# EAGLE design WeMos-Matrix-Shield-DMA (EAGLE 7.7.0)
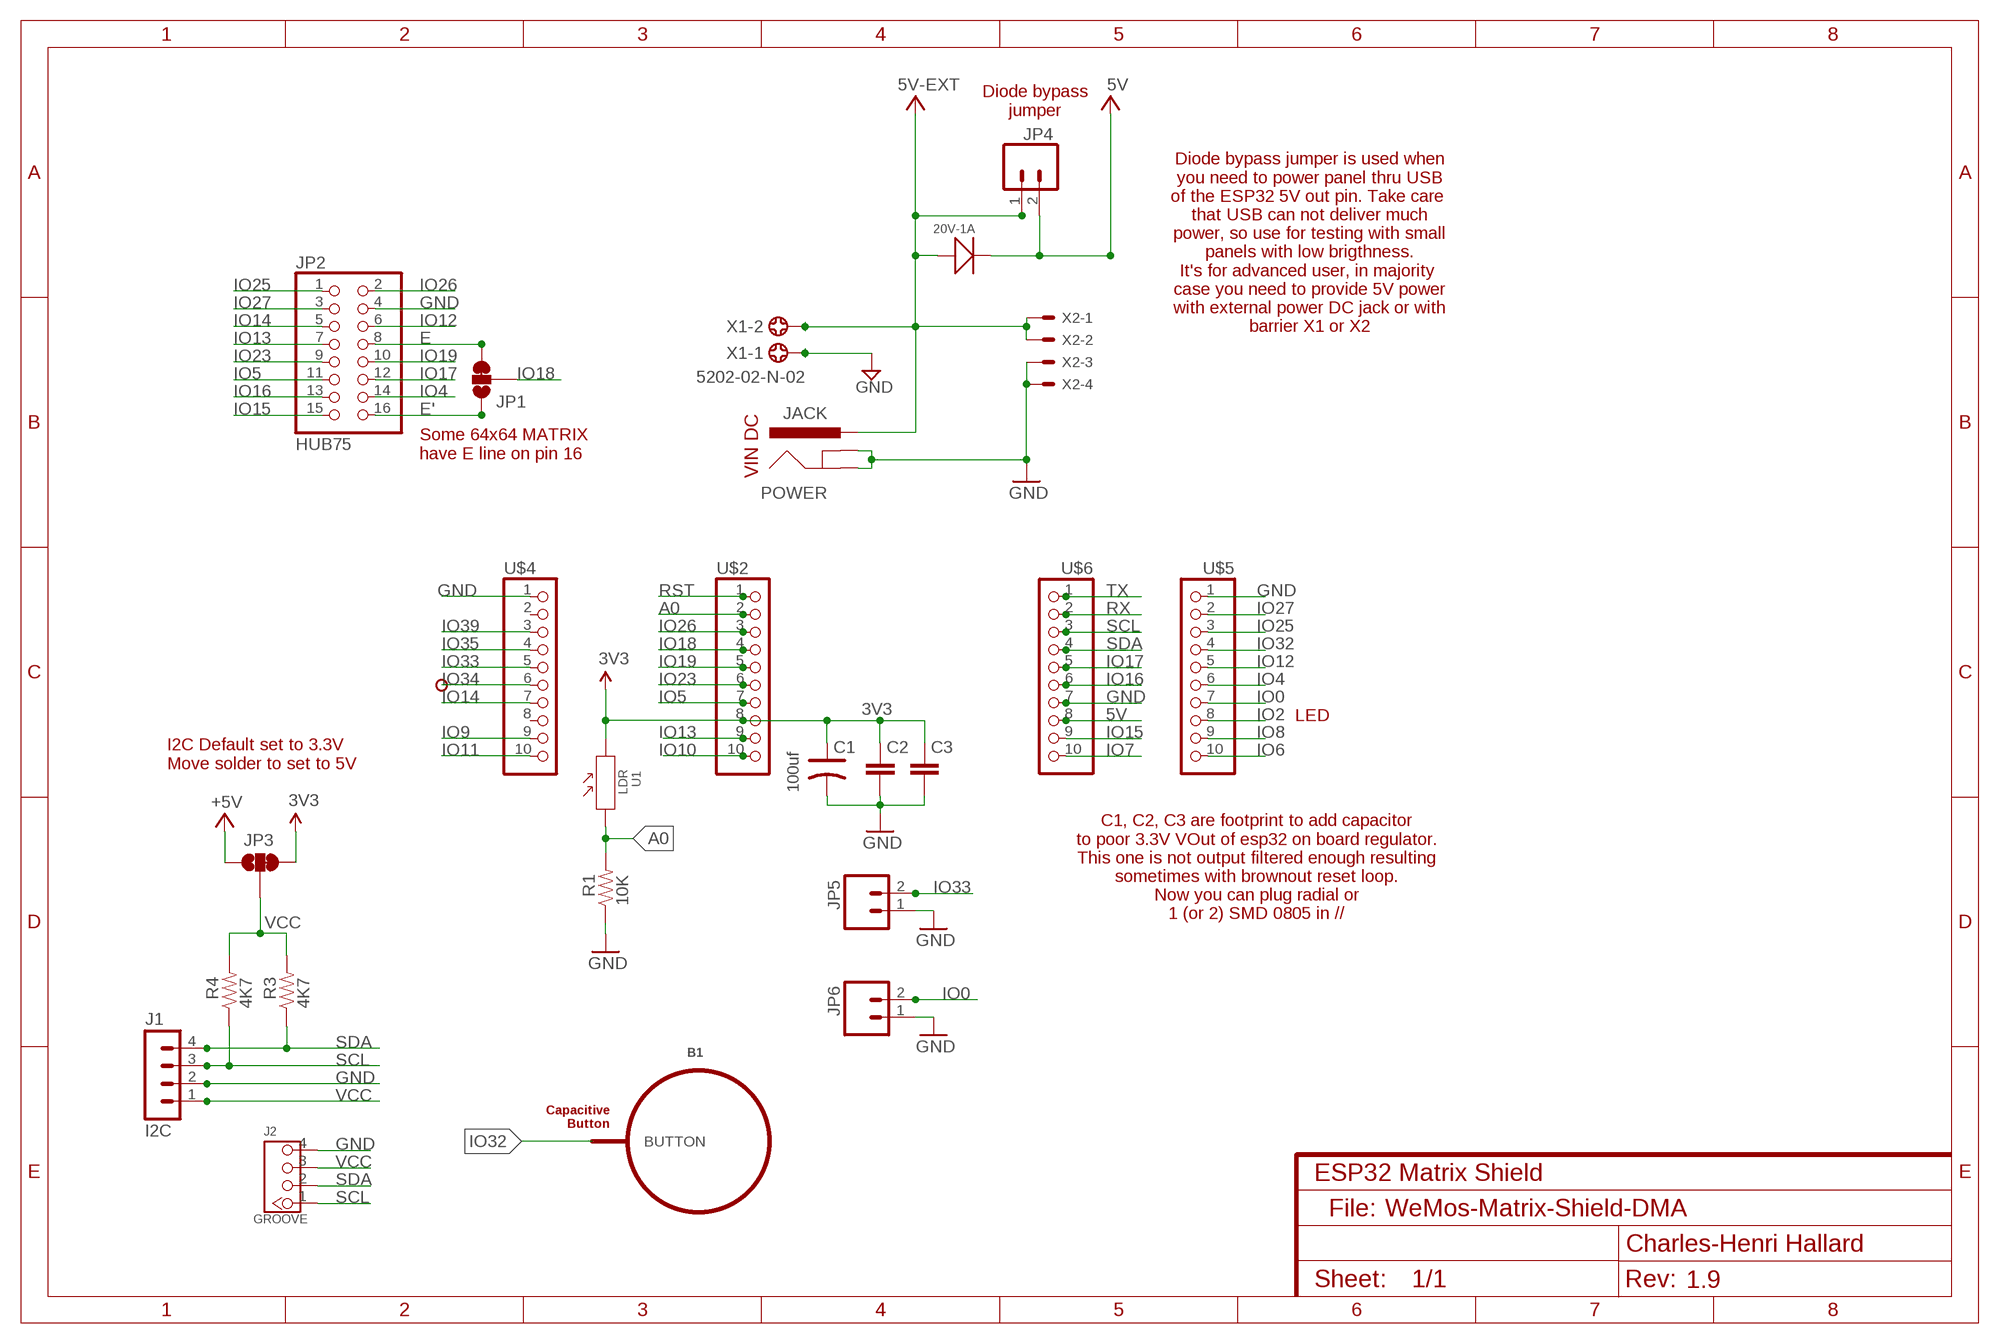
[diagram p0: schematic, sheet 1]
NAME (FRAME-A4L): CNAME: ESP32 Matrix Shield; CREVISION: 1.9; DESIGNER: Charles-Henri Hallard

## Parts
B1  BUTTON_PASSIVE6MM  [BUTTON_PASSIVE_6MM]
C1  100uf  DIP-ALUMINUM-47UF-16V(D5-H7MM)  [PC-D5.3MM]
C2  CAP0805-CAP-LARGEPADS  [0805-CAP-LARGEPADS]
C3  CAP0805-CAP-LARGEPADS  [0805-CAP-LARGEPADS]
D3  20V-1A  SMD-DIODE-SCHOTTKY-20V-1A(SOD-123)  [SOD-123]
J1  I2C  CON_HEADER_1X04SMALLHOLE  [1X04_LOCK_HOLE]
J2  GROOVE  TWIG-2.0-DIP  [2.0_1X4]
JACK  POWER  POWER_JACKPTH  [POWER_JACK_PTH]
JP1  JUMPER-PAD-3-2OF3_NC_BY_TRACE_LARGE  [PAD-JUMPER-3-2OF3_NC_BY_TRACE_YES_SILK_LARGE]
JP2  HUB75  HEADER-2X8  [2X08]
JP3  JUMPER-PAD-3-2OF3_NC_BY_TRACE_LARGE  [PAD-JUMPER-3-2OF3_NC_BY_TRACE_YES_SILK_LARGE]
JP4  M02  [1X02]
JP5  M02  [1X02]
JP6  M02  [1X02]
P2  PADSMALL  [PAD-SMALL]
R1  10K  RESISTOR0805-RES  [0805-RES]
R3  4K7  RESISTOR0805-RES  [0805-RES]
R4  4K7  RESISTOR0805-RES  [0805-RES]
U1  LDR  PHOTORESISTOR-5528-10K(2P-5.0X4.2MM)  [SNR2-3.0]
U$2  PINHD-1X10  [1X10-BIG]
U$4  PINHD-1X10  [1X10-BIG]
U$5  PINHD-1X10  [1X10-BIG]
U$6  PINHD-1X10  [1X10-BIG]
X1  5202-02-N-02  [5202-02-N-02]
X2  KK-156-4  [KK-156-4]

## Nets
3V3: C1.+ C2.1 C3.1 JP3.3 U1.2 U$2.8
5V: D3.- JP3.1 JP4.2 U$6.8 ; supply symbol labelled +5V
5V-EXT: D3.+ JACK.PWR JP4.1 X1.2 X2.1 X2.2
A0: R1.2 U1.1 U$2.2
E: JP1.3 JP2.8
E': JP1.1 JP2.16
GND: C1.- C2.2 C3.2 J1.2 J2.4 JACK.GND JACK.GNDBREAK JP2.4 JP5.1 JP6.1 R1.1 U$4.1 U$5.1 U$6.7 X1.1 X2.3 X2.4
IO0: JP6.2 U$5.7
IO2: U$5.8
IO4: JP2.14 U$5.6
IO5: JP2.11 U$2.7
IO6: U$5.10
IO7: U$6.10
IO8: U$5.9
IO9: U$4.9
IO10: U$2.10
IO11: U$4.10
IO12: JP2.6 U$5.5
IO13: JP2.7 U$2.9
IO14: JP2.5 U$4.7
IO15: JP2.15 U$6.9
IO16: JP2.13 U$6.6
IO17: JP2.12 U$6.5
IO18: JP1.2 U$2.4
IO19: JP2.10 U$2.5
IO23: JP2.9 U$2.6
IO25: JP2.1 U$5.3
IO26: JP2.2 U$2.3
IO27: JP2.3 U$5.2
IO32: B1.BUTTON U$5.4
IO33: JP5.2 U$4.5
IO34: P2.1 U$4.6
IO35: U$4.4
IO39: U$4.3
RST: U$2.1
RX: U$6.2
SCL: J1.3 J2.1 R4.1 U$6.3
SDA: J1.4 J2.2 R3.1 U$6.4
TX: U$6.1
VCC: J1.1 J2.3 JP3.2 R3.2 R4.2
Unconnected: U$4.2 U$4.8

## Notes on the sheet
- Diode bypass
  jumper
- Diode bypass jumper is used when
  you need to power panel thru USB
  of the ESP32 5V out pin. Take care 
  that USB can not deliver much
  power, so use for testing with small
  panels with low brigthness.
  It's for advanced user, in majority 
  case you need to provide 5V power
  with external power DC jack or with
  barrier X1 or X2
- VIN DC
- Some 64x64 MATRIX
  have E line on pin 16
- LED
- I2C Default set to 3.3V 
  Move solder to set to 5V
- C1, C2, C3 are footprint to add capacitor
  to poor 3.3V VOut of esp32 on board regulator.
  This one is not output filtered enough resulting
  sometimes with brownout reset loop.
  Now you can plug radial or
  1 (or 2) SMD 0805 in //
- File:

## Library data of the parts
B1 = PatternAgents-TouchWidgets:BUTTON_PASSIVE: Button, Passive Capacitive/Touch Sensing Type Source : http://www.PatternAgents.com Github : https://github.com/PatternAgents License : http://creativecommons.org/licenses/by-sa/3.1/ (Creative Commons 3.1) THIS SOFTWARE IS PROVIDED BY THE CONTRIBUTORS "AS IS" AND WITHOUT ANY EXPRESS OR IMPLIED WARRANTIES, INCLUDING, BUT NOT LIMITED TO, THE IMPLIED WARRANTIES OF MERCHANTABILITY AND FITNESS FOR A PARTICULAR PURPOSE ARE DISCLAIMED. IN NO EVENT SHALL THE COPYRIGHT OWNER OR CONTRIBUTORS BE LIABLE FOR ANY DIRECT, INDIRECT, INCIDENTAL, SPECIAL, EXEMPLARY, OR CONSEQUENTIAL DAMAGES (INCLUDING, BUT NOT LIMITED TO, PROCUREMENT OF SUBSTITUTE GOODS OR SERVICES; LOSS OF USE, DATA, OR PROFITS; OR BUSINESS INTERRUPTION) HOWEVER CAUSED AND ON ANY THEORY OF LIABILITY, WHETHER IN CONTRACT, STRICT LIABILITY, OR TORT (INCLUDING NEGLIGENCE OR OTHERWISE) ARISING IN ANY WAY OUT OF THE USE OF THIS SOFTWARE, EVEN IF ADVISED OF THE POSSIBILITY OF SUCH DAMAGE.
C1 = Seeed-Capacitor:DIP-ALUMINUM-47UF-16V(D5-H7MM): 302030033; MPN: KS 100uF/16V
C2 C3 = _c2h:CAP: Capacitor Standard 0603 ceramic capacitor, and 0.1" leaded capacitor.
D3 = Seeed-Diode:SMD-DIODE-SCHOTTKY-20V-1A(SOD-123): 304020034; MPN: B5819W
J1 = _c2h:CON_HEADER_1X04
J2 = Connector:TWIG-2.0-DIP
JACK = SparkFun-Connectors:POWER_JACK: Power Jack This is the standard 5.5mm barrel jack for power. The PTH is the most common, proven, reliable, footprint. The Slot footprint only works if the mill layer is transmitted to the PCB fab house so be warned. Spark Fun Electronics SKU : PRT-00119 SMT: CONN-08106 Mating wall wart : TOL-00298 (and others)
JP1 JP3 = _c2h:JUMPER-PAD-3-2OF3_NC_BY_TRACE
JP2 = microbuilder:HEADER-2X8
JP4-JP6 = PatternAgents-ProtoPads:M02
P2 = _c2h:PAD
R1 R3 R4 = _c2h:RESISTOR: Resistor Basic schematic elements and footprints for 0603, 1206, and PTH resistors.
U1 = Seeed-Sensor:PHOTORESISTOR-5528-10K(2P-5.0X4.2MM): 314020017; MPN: PHOTORESISTOR-5528-10K; VALUE: PHOTORESISTOR-5528-10K
U$2 U$4-U$6 = adafruit:PINHD-1X10: Pin header 1x10 0.1" spacing With round pins
X1 = _c2h:5202-02-N-02: Barrier Blocks Sreies 5202 Source: http://www.ebyelectro.com/PDF/5202-XX-N-02.pdf
X2 = con-molex:KK-156-4: KK 156 HEADER Source: http://www.molex.com/pdm_docs/sd/026604100_sd.pdf; OC_FARNELL: unknown; OC_NEWARK: unknown

## Net classes
0 default: width 0.203 mm, drill 0.356 mm, clearance 0.152 mm
1 power: width 0.203 mm, clearance 0.152 mm

## Board
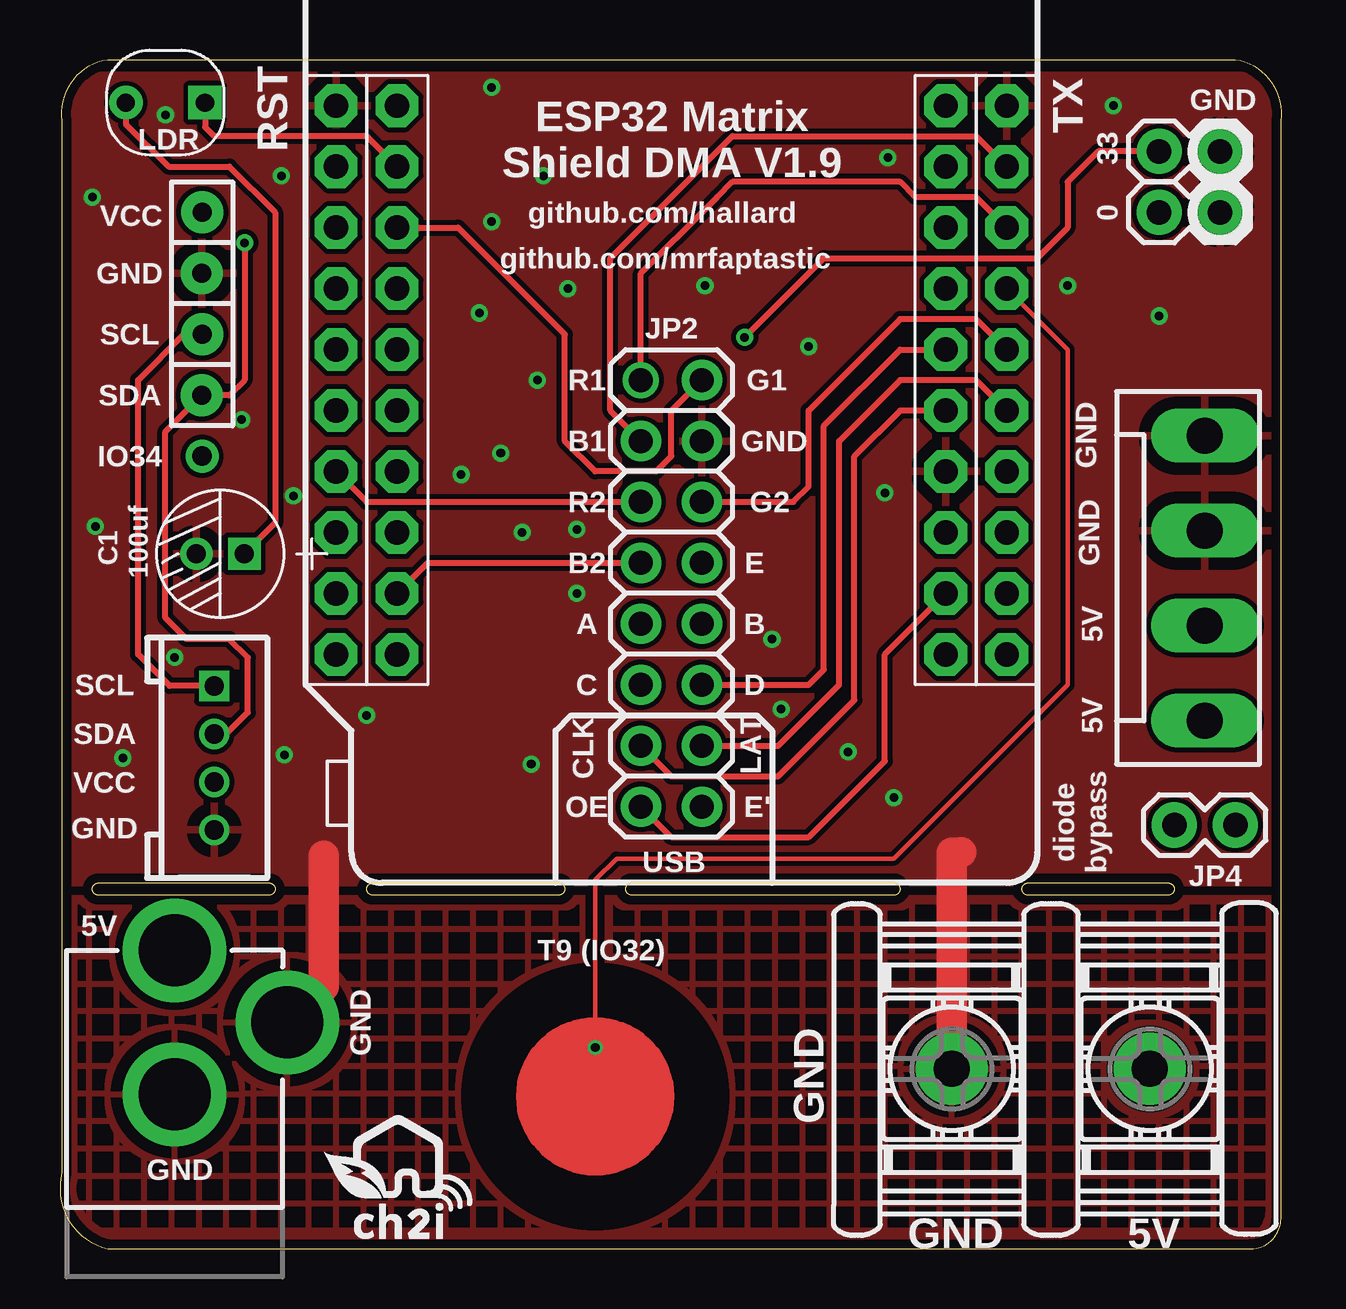
[diagram p1: board, top side]
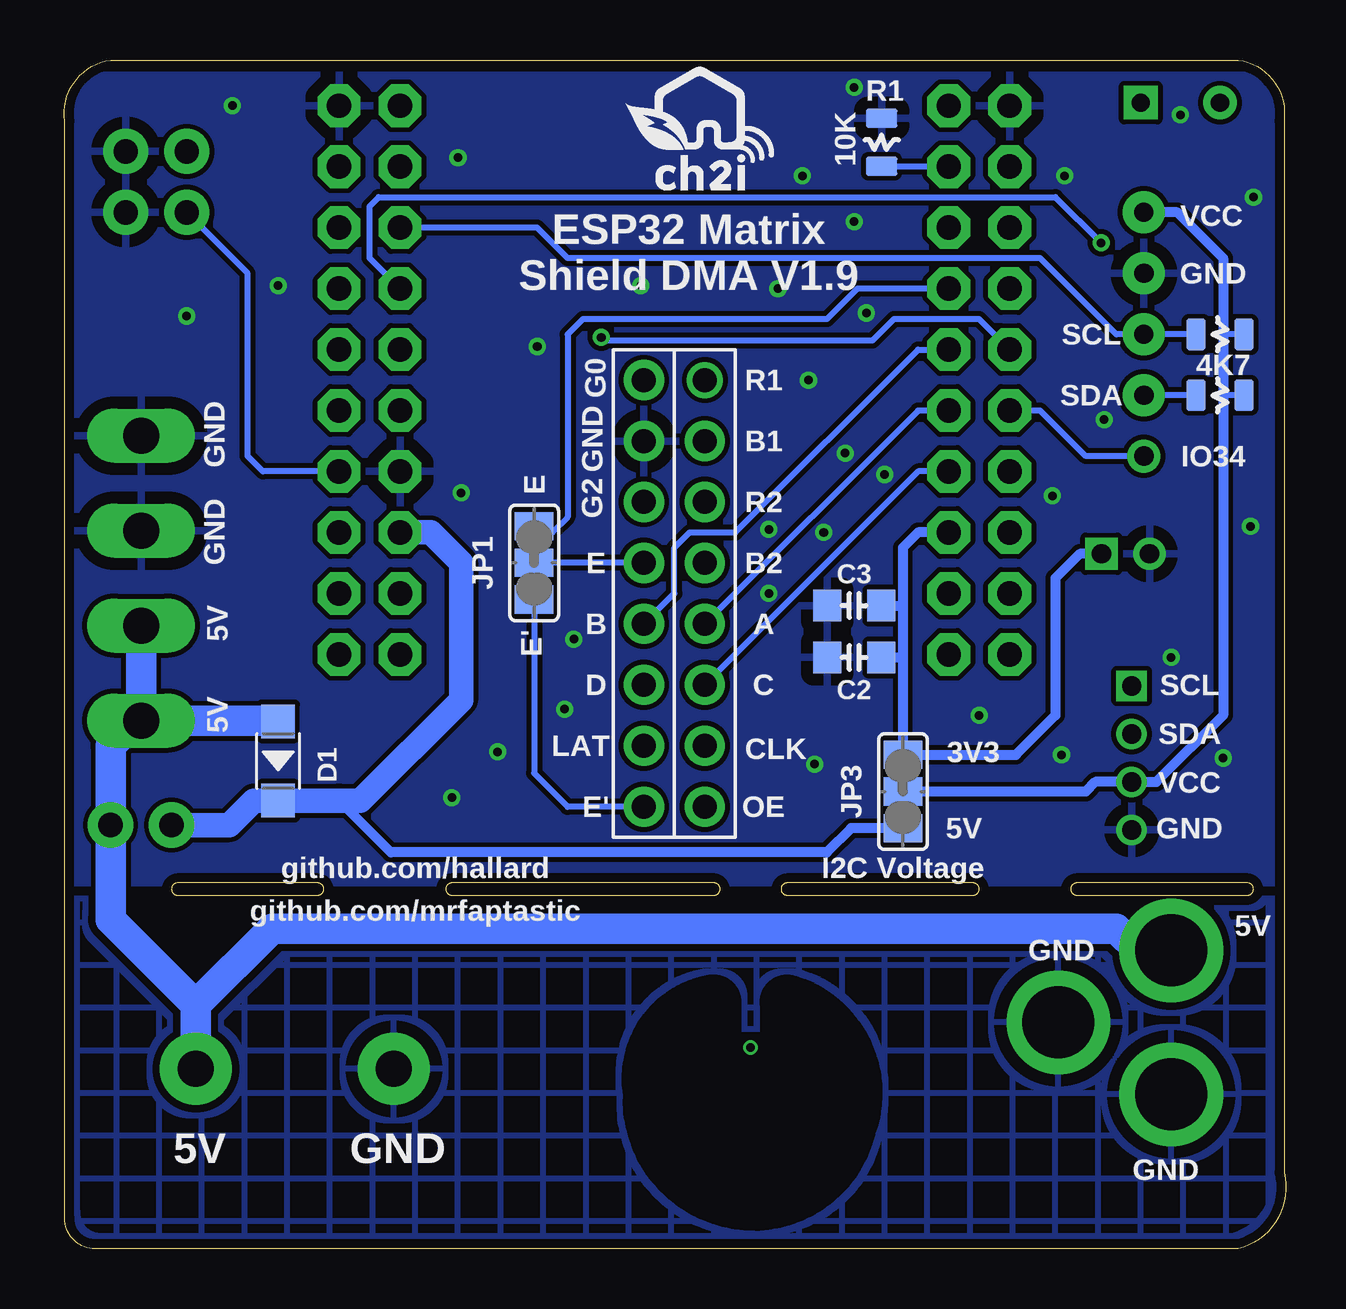
[diagram p2: board, bottom side, seen from below]

Size 50.9 x 49.53 mm. Coordinates in mm from the lower left corner, seen from the top.
Outline: 1.98,49.53 arc90 0.08,46.99 0.08,3.17 arc90 1.98,0 49.61,0 arc90 50.88,1.27 50.88,46.99 arc90 48.97,49.53 1.98,49.53
Outline: 1.35,14.99 arc-90 1.6,15.24 8.71,15.24 arc-90 8.97,14.99 arc-90 8.71,14.73 1.6,14.73 arc-90 1.35,14.99
Outline: 40.08,14.99 arc-90 40.34,15.24 46.18,15.24 arc-90 46.43,14.99 arc-90 46.18,14.73 40.34,14.73 arc-90 40.08,14.99
Outline: 12.78,14.99 arc-90 13.03,15.24 20.78,15.24 arc-90 21.03,14.99 arc-90 20.78,14.73 13.03,14.73 arc-90 12.78,14.99
Outline: 23.57,14.99 arc-90 23.83,15.24 34.75,15.24 arc-90 35,14.99 arc-90 34.75,14.73 23.83,14.73 arc-90 23.57,14.99
Copper layers (1*16): Top 0.035559375mm / dielectric 1.6mm / Bottom 0.035559375mm
Design rules "oshpark-2layer-tented *": minimum track width 6mil, minimum drill 10mil, track to track 6mil, track to pad 6mil, pad to pad 6mil, via to via 6mil, smd to smd 6mil, copper to edge 15mil, drill to drill 6mil, minimum pad ring 5mil, minimum via ring 5mil, stop-mask expansion 2.5mil, vias tented up to drill 30mil, thermal gap 20mil

### Footprints (pad centres in the part's own frame; a part is rotated, then mirrored left to right if it is on the bottom)
BUTTON_PASSIVE_6MM = drill 0.356: BUTTON 0,2.032
PC-D5.3MM = drill 0.8 pad 1.35 square: + -1,0 | drill 0.8 pad 1.35: - 1,0
0805-CAP-LARGEPADS = smd 1.156 x 1.3: 1 -1.127,0; 2 1.127,0
SOD-123 = smd 1.397 x 1.397: + -1.651,0; - 1.651,0
1X04_LOCK_HOLE = drill 0.798 pad 1.753: 1 -3.816,-0.121; 2 -1.27,-0.133; 3 1.27,-0.121; 4 3.81,-0.133
2.0_1X4 = drill 0.8 pad 1.27 square: 1 -3,0 | drill 0.8 pad 1.27: 2 -1,0; 3 1,0; 4 3,0
POWER_JACK_PTH = drill 2.997 pad 4.318: GND 0,7.7; GNDBREAK 4.7,10.7; PWR 0,13.7
PAD-JUMPER-3-2OF3_NC_BY_TRACE_YES_SILK_LARGE = smd 1.168 x 1.6: 1 -1.524,0; 2 0,0; 3 1.524,0
2X08 = drill 1: 1 -8.89,-1.27 | drill 1 pad 1.676: 2 -8.89,1.27; 3 -6.35,-1.27; 4 -6.35,1.27; 5 -3.81,-1.27; 6 -3.81,1.27; 7 -1.27,-1.27; 8 -1.27,1.27; 9 1.27,-1.27; 10 1.27,1.27; 11 3.81,-1.27; 12 3.81,1.27; 13 6.35,-1.27; 14 6.35,1.27; 15 8.89,-1.27; 16 8.89,1.27
1X02 = drill 1.016 pad 1.88: 1 0,0; 2 2.54,0
PAD-SMALL = drill 0.813 pad 1.372: 1 0,0
0805-RES = smd 0.8 x 1.3: 1 -1,0; 2 1,0
SNR2-3.0 = drill 0.762 pad 1.397 square: 1 -1.651,0 | drill 0.762 pad 1.397: 2 1.651,0
1X10-BIG = drill 1.016 pad 1.778 octagon: 1 -11.43,0; 2 -8.89,0; 3 -6.35,0; 4 -3.81,0; 5 -1.27,0; 6 1.27,0; 7 3.81,0; 8 6.35,0; 9 8.89,0; 10 11.43,0
5202-02-N-02 = drill 1.5 pad 3: 1 -8.25,0; 2 0,0
KK-156-4 = drill 1.5 pad 1.93 long: 1 -5.94,0; 2 -1.98,0; 3 1.98,0; 4 5.94,0

### Placement (x,y rotation side)
B1  22.3,6.35 0 top
C1  6.68,28.96 180 top
C2  17.98,24.64 180 bottom
C3  17.98,26.8 180 bottom
D3  41.99,20.32 270 bottom
J1  6.05,39.37 270 top
J2  6.43,20.45 270 top
JACK  4.78,-1.27 0 top
JP1  31.32,28.58 90 bottom
JP2  25.48,27.3 270 top
JP3  15.95,19.05 90 bottom
JP4  48.97,17.65 180 top
JP5  48.34,45.72 180 top
JP6  48.34,43.18 180 top
P2  5.92,33.02 0 top
R1  16.84,46.1 270 bottom
R3  2.74,35.56 0 bottom
R4  2.74,38.1 0 bottom
U1  4.39,47.75 180 top
U$2  14.05,36.2 270 top
U$4  11.51,36.2 270 top
U$5  39.45,36.2 270 top
U$6  36.91,36.2 270 top
U$7  [LOGO_C2I_015]  11,0.38 0 top
U$8  [LOGO_C2I_015]  27.51,44.07 0 bottom
X1  45.42,7.49 0 top
X2  47.7,27.94 90 top

### Tracks (layer width: path | path; a pad name or v marks a point on that pad's centre or on a via)
3V3
  Top 0.254: 2.74,47.5 2.74,46.86 4.52,45.09 7.06,45.09 8.97,43.18 8.97,30.24 C1.+
  Top 0.305: U1.2 2.74,47.5
  Bottom 0.406: C1.+ 8.59,28.96 9.6,27.94 9.6,22.23 11.25,20.57 JP3.3 15.95,24.77 | U$2.8 15.32,29.84 15.95,29.21 15.95,26.67 | 15.95,26.67 15.95,24.77 | C3.1 16.08,26.8 15.95,26.67 | C2.1 16.08,24.64 15.95,24.77
5V
  Bottom 0.406: JP3.1 18.11,17.53 19.13,16.51 37.29,16.51 39.45,18.67
  Bottom 1.016: U$6.8 35.64,29.84 34.37,28.58 34.37,22.86 38.56,18.67 39.45,18.67 D3.- 43,18.67 44.02,17.65 JP4.2
5V-EXT
  Top 1.016: 47.63,26.04 X2.2
  Bottom 1.27: 47.7,22.23 X2.2 | JACK.PWR 6.16,12.43 7.06,13.33 42.24,13.33 45.42,10.16 | X1.2 45.42,10.16 | 47.7,22.23 X2.1 42.02,22 D3.+ | 47.7,22.23 48.97,20.95 JP4.1 48.97,13.72 45.42,10.16
A0
  Top 0.254: U1.1 6.05,46.74 6.43,46.36 12.78,46.36 U$2.2
  Bottom 0.254: R1.2 14.06,45.1 U$2.2
E
  Bottom 0.254: JP2.8 31.19,28.58
  Bottom 0.305: JP1.3 31.32,28.7 31.19,28.58
E'
  Bottom 0.254: JP2.16 29.92,18.41 31.32,19.81 JP1.1
GND  (via drill 0.36 pad 0.71)
  Top 1.27: JACK.GNDBREAK 11,10.92 11,16.38 | X1.1 37.17,16.51 37.54,16.51
  other vias: 29.67,25.4 2.62,20.45 34.75,18.8 19.63,20.19 16.71,32.26 34.37,31.5 9.35,20.57 26.87,40.13 21.54,29.97 30.05,22.48 20.14,44.7 21.16,40.01 12.78,22.23 19.89,36.2 1.47,30.1 17.98,48.39 43.89,47.62 1.35,43.82 31.19,37.59 4.39,47.24 41.99,40.13 9.22,44.7 32.84,20.7 19.25,29.84 21.54,27.3 18.36,33.15 45.8,38.86 17.48,38.99 17.98,42.8 34.49,45.47 9.73,31.37 7.57,34.54 4.78,24.64
  pour Top (isolate 0.203): 52.15,48.9 -1.19,48.9 -1.19,15.24 52.15,15.24
  pour Bottom (isolate 0.203): 51.51,15.24 51.51,48.9 -0.56,48.9 -0.56,15.24
  pour Bottom (isolate 0.305, hatched): 51.51,-1.27 51.51,14.6 -0.56,14.6 -0.56,-1.27
  pour Top (isolate 0.305, hatched): 52.15,14.6 -1.19,14.6 -1.19,-0.63 52.15,-0.63
IO0
  Bottom 0.254: U$5.7 42.62,32.38 43.26,33.02 43.26,40.64 JP6.2
IO4
  Top 0.254: JP2.14 29.92,20.95 32.46,23.5 32.46,33.66 35,36.2 38.18,36.2 U$5.6
IO5
  Bottom 0.254: U$2.7 15.32,32.38 JP2.11
IO12
  Top 0.254: JP2.6 30.56,31.12 31.19,31.75 31.19,34.93 35,38.73 38.18,38.73 U$5.5
IO13
  Top 0.254: JP2.7 15.32,28.58 U$2.9
IO14
  Top 0.254: U$4.7 12.78,31.12 JP2.5
IO15
  Top 0.254: JP2.15 25.48,17.15 31.19,17.15 34.37,20.32 34.37,24.77 U$6.9
IO16
  Top 0.254: JP2.13 25.48,19.69 29.92,19.69 33.1,22.86 33.1,33.02 35,34.93 U$6.6
IO17
  Top 0.254: JP2.12 31.19,23.5 31.83,24.13 31.83,34.29 35,37.47 U$6.5
IO18
  Bottom 0.254: 31.32,29.84 30.56,29.84 29.92,30.48 29.92,38.1 29.29,38.73 19.13,38.73 17.86,40.01 U$2.4
IO19
  Bottom 0.254: JP2.10 25.48,27.3 25.48,29.21 24.84,29.84 22.94,29.84 15.32,37.47 U$2.5
IO23
  Bottom 0.254: U$2.6 15.32,34.93 JP2.9
IO25
  Top 0.254: JP2.1 24.21,40.64 27.06,43.5 27.38,43.82 28.02,44.45 35,44.45 35.64,43.82 38.18,43.82 U$5.3
IO26
  Top 0.254: JP2.2 25.48,34.93 25.48,33.02 24.84,32.38 22.3,32.38 21.03,33.66 21.03,38.1 16.59,42.55 U$2.3
IO27
  Top 0.254: JP2.3 22.94,34.93 22.94,41.27 28.02,46.36 38.18,46.36 U$5.2
IO32
  Top 0.178: B1.BUTTON 22.3,15.37 23.19,16.26 34.75,16.26 41.99,23.5 41.99,37.47 U$5.4
IO33  (via drill 0.36 pad 0.71)
  Top 0.254: v28.52,37.97 31.83,41.27 40.72,41.27 41.99,42.55 41.99,44.45 43.26,45.72 JP5.2
  Bottom 0.254: v28.52,37.97 28.4,37.85 17.22,37.85 16.33,38.73 12.78,38.73 U$4.5
IO34
  Bottom 0.254: P2.1 8.33,33.02 10.24,34.93 U$4.6
SCL
  Top 0.254: J2.1 4.57,23.45 3.25,24.77 3.25,36.2 5.16,38.1 J1.3
  Bottom 0.254: U$6.3 31.19,42.55 29.92,41.27 10.24,41.27 7.06,38.1 J1.3 | 5.16,38.1 J1.3 | R4.1 J1.3
SDA  (via drill 0.36 pad 0.71)
  Top 0.254: J2.2 6.92,21.45 7.82,22.35 7.82,24.64 7.06,25.4 5.28,25.4 4.39,26.29 4.39,34.04 J1.4 7.06,35.56 7.7,36.2 v7.7,41.91
  Bottom 0.254: U$6.4 38.18,41.27 38.18,43.43 37.8,43.82 9.6,43.82 v7.7,41.91 | R3.1 J1.4
VCC
  Bottom 0.254: R4.2 2.62,38.1 | R3.2 2.62,35.56
  Bottom 0.406: JP3.2 8.33,19.05 7.93,19.45 J2.3 5.39,19.45 2.62,22.23 2.62,35.56 2.62,38.1 2.62,41.27 4.52,43.18 J1.1

### Text on the board
tPlace: github.com/hallard | github.com/mrfaptastic | diode / bypass
bPlace: github.com/hallard | github.com/mrfaptastic
tNames: RST | TX | GND | ESP32 Matrix / Shield DMA V1.9 | 33 | VCC | 0 | GND | SCL | R1 | G1 | SDA | IO34 | B1 | GND | GND | R2 | G2 | GND | B2 | E | A | B | 5V | SCL | C | D | 5V | SDA | LAT | CLK | VCC | OE | E' | GND | USB | 5V | T9 (IO32) | GND | GND | GND | GND | 5V
bNames: VCC | ESP32 Matrix / Shield DMA V1.9 | GND | SCL | R1 | G0 | SDA | IO34 | B1 | GND | GND | R2 | G2 | E | GND | B2 | E | A | B | 5V | E' | SCL | C | D | 5V | SDA | 3V3 | CLK | LAT | D1 | VCC | OE | E' | GND | 5V | I2C Voltage | 5V | GND | GND | 5V | GND